# EAGLE design MG-Gadget (EAGLE 7.6.0)
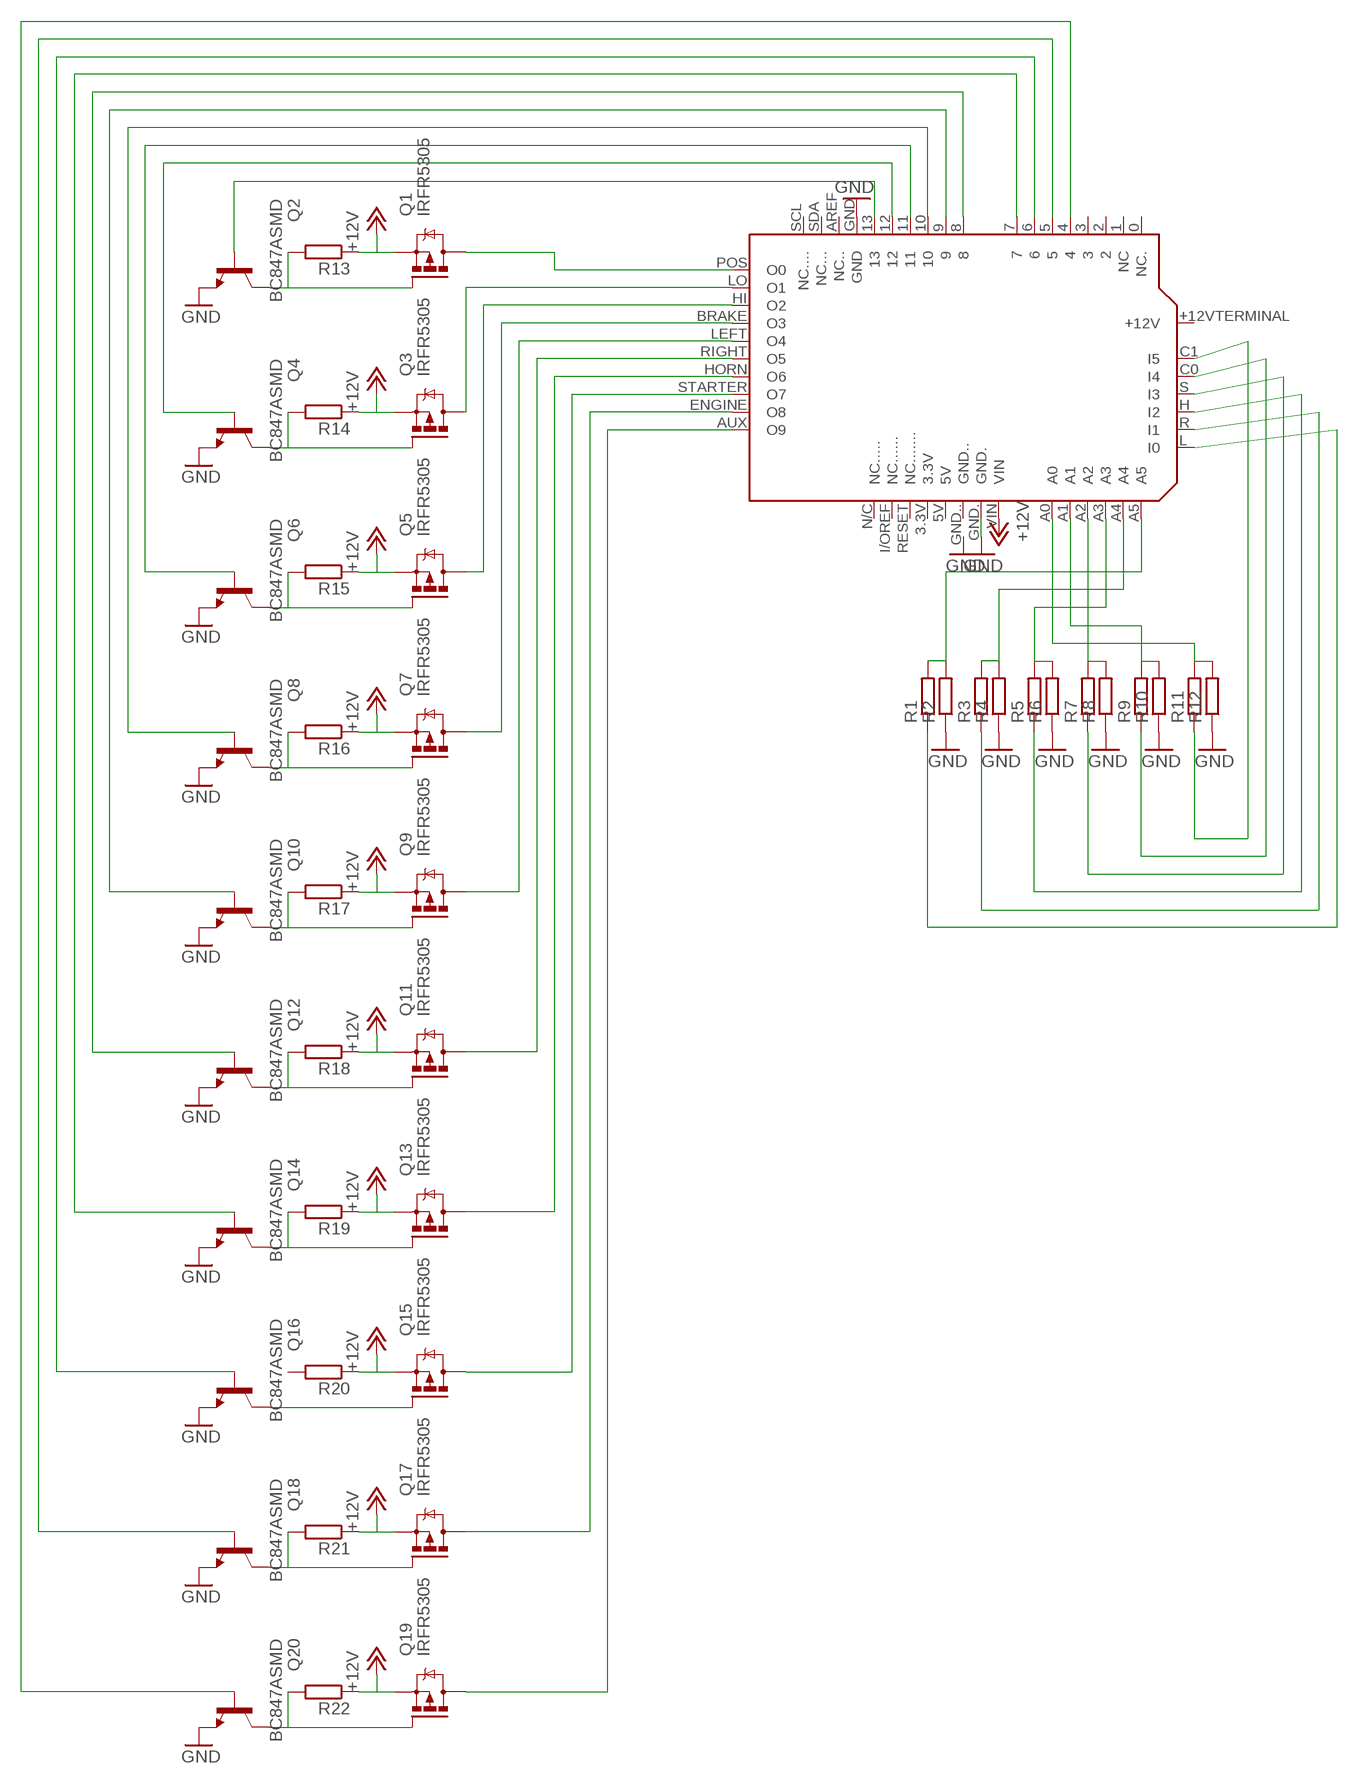
[diagram p0: schematic, sheet 1]

## Parts
PCB1  ARDUINO_UNO  [ARDUINO_UNO]
Q1  IRFR5305  [D-PAK_TO252AA]
Q2  BC847ASMD  [SOT23]
Q3  IRFR5305  [D-PAK_TO252AA]
Q4  BC847ASMD  [SOT23]
Q5  IRFR5305  [D-PAK_TO252AA]
Q6  BC847ASMD  [SOT23]
Q7  IRFR5305  [D-PAK_TO252AA]
Q8  BC847ASMD  [SOT23]
Q9  IRFR5305  [D-PAK_TO252AA]
Q10  BC847ASMD  [SOT23]
Q11  IRFR5305  [D-PAK_TO252AA]
Q12  BC847ASMD  [SOT23]
Q13  IRFR5305  [D-PAK_TO252AA]
Q14  BC847ASMD  [SOT23]
Q15  IRFR5305  [D-PAK_TO252AA]
Q16  BC847ASMD  [SOT23]
Q17  IRFR5305  [D-PAK_TO252AA]
Q18  BC847ASMD  [SOT23]
Q19  IRFR5305  [D-PAK_TO252AA]
Q20  BC847ASMD  [SOT23]
R1  R-EU_R0805  [R0805]
R2  R-EU_R0805  [R0805]
R3  R-EU_R0805  [R0805]
R4  R-EU_R0805  [R0805]
R5  R-EU_R0805  [R0805]
R6  R-EU_R0805  [R0805]
R7  R-EU_R0805  [R0805]
R8  R-EU_R0805  [R0805]
R9  R-EU_R0805  [R0805]
R10  R-EU_R0805  [R0805]
R11  R-EU_R0805  [R0805]
R12  R-EU_R0805  [R0805]
R13  R-EU_R0805  [R0805]
R14  R-EU_R0805  [R0805]
R15  R-EU_R0805  [R0805]
R16  R-EU_R0805  [R0805]
R17  R-EU_R0805  [R0805]
R18  R-EU_R0805  [R0805]
R19  R-EU_R0805  [R0805]
R20  R-EU_R0805  [R0805]
R21  R-EU_R0805  [R0805]
R22  R-EU_R0805  [R0805]

## Nets
+12V: PCB1.VIN Q1.3(S) Q3.3(S) Q5.3(S) Q7.3(S) Q9.3(S) Q11.3(S) Q13.3(S) Q15.3(S) Q17.3(S) Q19.3(S) R13.1 R14.1 R15.1 R16.1 R17.1 R18.1 R19.1 R20.1 R21.1 R22.1
GND: PCB1.GND PCB1.GND. Q2.2(E) Q4.2(E) Q6.2(E) Q8.2(E) Q10.2(E) Q12.2(E) Q14.2(E) Q16.2(E) Q18.2(E) Q20.2(E) R2.1 R4.1 R6.1 R8.1 R10.1 R12.1
N$1: PCB1.A5 R1.2 R2.2
N$2: PCB1.A4 R3.2 R4.2
N$3: PCB1.A3 R5.2 R6.2
N$4: PCB1.A2 R7.2 R8.2
N$5: PCB1.A1 R9.2 R10.2
N$6: PCB1.A0 R11.2 R12.2
N$7: PCB1.C1(I5) R11.1
N$8: PCB1.C0(I4) R9.1
N$9: PCB1.S(I3) R7.1
N$10: PCB1.H(I2) R5.1
N$11: PCB1.R(I1) R3.1
N$12: PCB1.L(I0) R1.1
N$13: Q1.1(G) Q2.3(C) R13.2
N$15: PCB1.POS(O0) Q1.4(D)
N$16: Q3.1(G) Q4.3(C) R14.2
N$18: Q5.1(G) Q6.3(C) R15.2
N$19: PCB1.13 Q2.1(B)
N$20: Q7.1(G) Q8.3(C) R16.2
N$21: PCB1.12 Q4.1(B)
N$22: Q9.1(G) Q10.3(C) R17.2
N$23: PCB1.11 Q6.1(B)
N$24: Q11.1(G) Q12.3(C) R18.2
N$25: PCB1.10 Q8.1(B)
N$26: Q13.1(G) Q14.3(C) R19.2
N$27: PCB1.9 Q10.1(B)
N$28: Q15.1(G) Q16.3(C)
N$29: PCB1.8 Q12.1(B)
N$30: Q17.1(G) Q18.3(C) R21.2
N$31: PCB1.7 Q14.1(B)
N$32: Q19.1(G) Q20.3(C) R22.2
N$33: PCB1.6 Q16.1(B)
N$34: PCB1.LO(O1) Q3.4(D)
N$35: PCB1.HI(O2) Q5.4(D)
N$36: PCB1.BRAKE(O3) Q7.4(D)
N$37: PCB1.LEFT(O4) Q9.4(D)
N$38: PCB1.RIGHT(O5) Q11.4(D)
N$39: PCB1.HORN(O6) Q13.4(D)
N$40: PCB1.STARTER(O7) Q15.4(D)
N$41: PCB1.ENGINE(O8) Q17.4(D)
N$42: PCB1.AUX(O9) Q19.4(D)
N$43: PCB1.5 Q18.1(B)
N$44: PCB1.4 Q20.1(B)
Unconnected: PCB1.0(NC.) PCB1.1(NC) PCB1.2 PCB1.3 PCB1.3.3V PCB1.5V PCB1.AREF(NC..) PCB1.GND.. PCB1.I/OREF(NC......) PCB1.N/C(NC.....) PCB1.RESET(NC.......) PCB1.SCL(NC....) PCB1.SDA(NC...) R20.2

## Power pins joined to a net without a drawn wire
+12V: PCB1.+12VTERMINAL(+12V)

## Library data of the parts
PCB1 = MG-Gadget Shield:ARDUINO_UNO: Device for representing an Arduino Uno board with a footprint in an EAGLE design. Created by Dave Young for Element14. More EAGLE documentation at: http://www.element14.com/community/community/knode/cadsoft_eagle
Q1 Q3 Q5 Q7 Q9 Q11 Q13 Q15 Q17 Q19 = transistor-power:IRF?5305: HEXFET Power MOSFET Source: http://www.irf.com/product-info/datasheets/data/irfr5305pbf.pdf
Q2 Q4 Q6 Q8 Q10 Q12 Q14 Q16 Q18 Q20 = transistor-npn:BC847*: NPN Transistor
R1-R22 = rcl:R-EU_: RESISTOR, European symbol

## Board
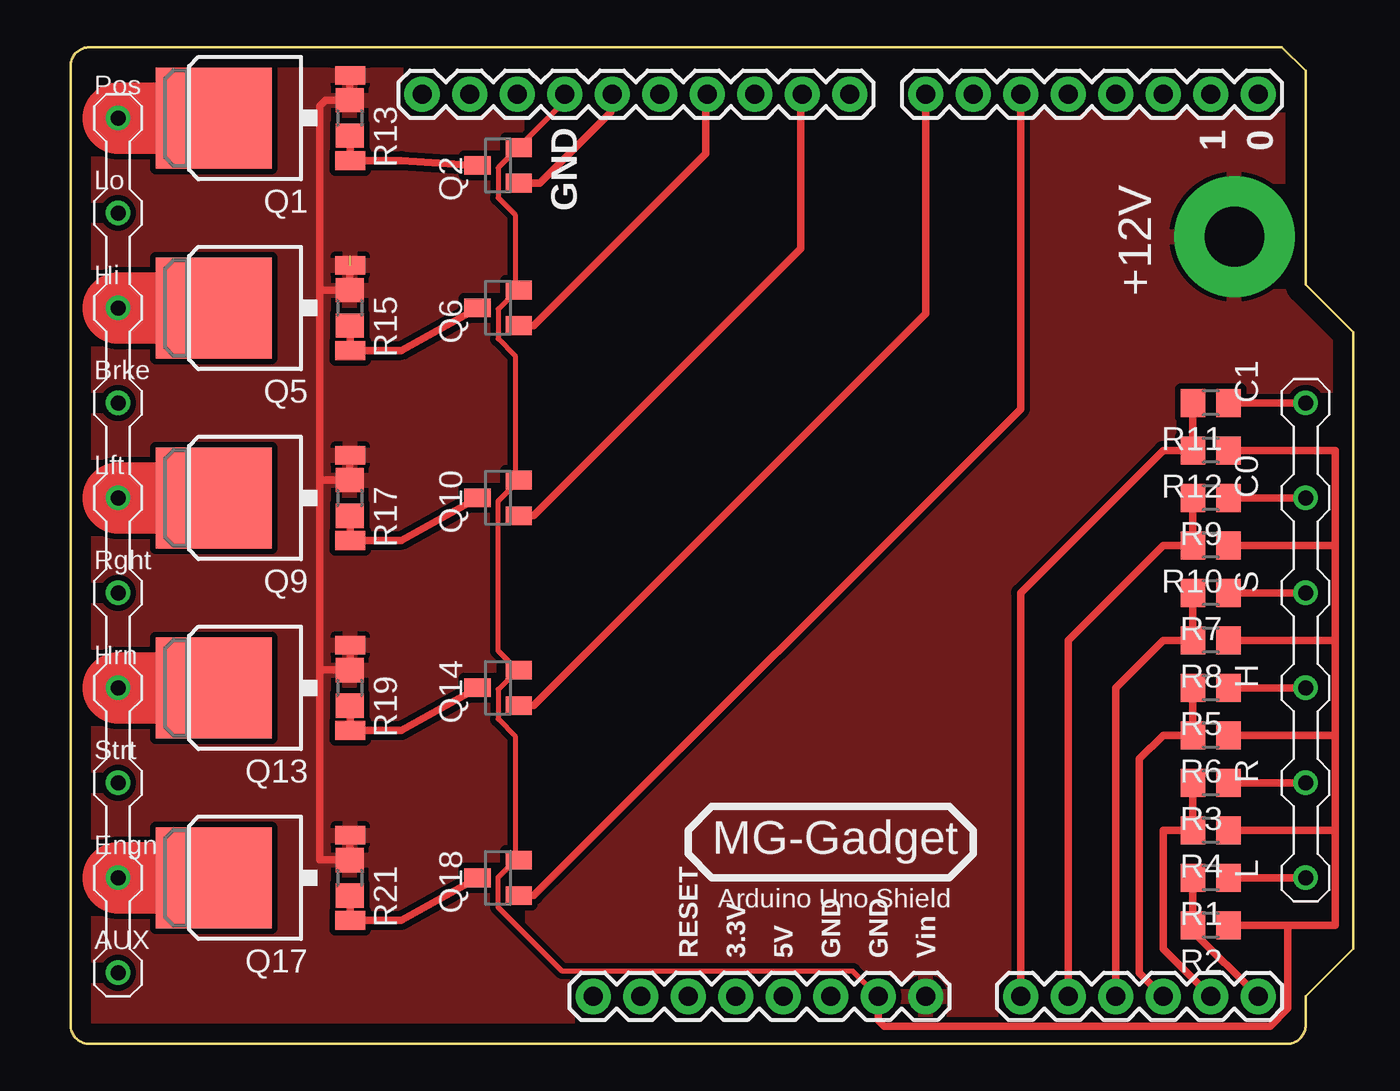
[diagram p1: board, top side]
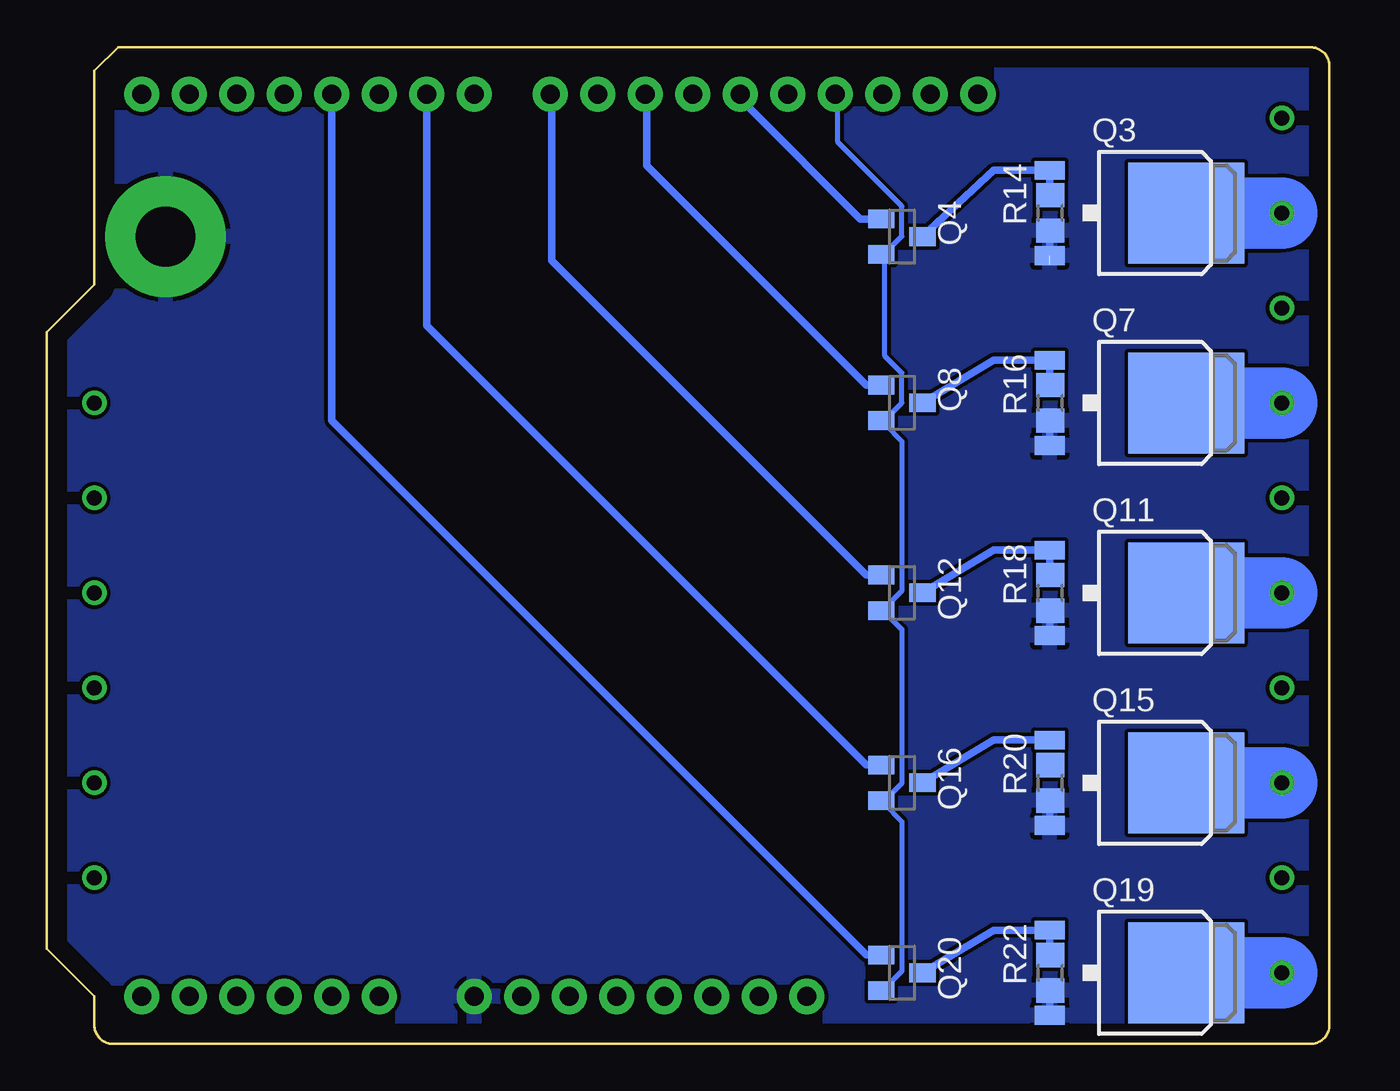
[diagram p2: board, bottom side, seen from below]

Size 68.58 x 53.31 mm. Coordinates in mm from the lower left corner, seen from the top.
Copper layers (1*16): Top 0.035mm / dielectric 1.5mm / Bottom 0.035mm
Design rules "default": minimum track width 10mil, minimum drill 24mil, track to track 8mil, track to pad 8mil, pad to pad 8mil, via to via 8mil, smd to smd 8mil, copper to edge 40mil, drill to drill 8mil, minimum pad ring 10mil, minimum via ring 8mil, stop-mask expansion 4mil, vias tented up to drill 0mil, thermal gap 10mil

### Footprints (pad centres in the part's own frame; a part is rotated, then mirrored left to right if it is on the bottom)
ARDUINO_UNO = drill 1.016 pad 1.88: 0 63.5,50.8; 1 60.96,50.8; 2 58.42,50.8; 3 55.88,50.8; 3.3V 35.56,2.54; 4 53.34,50.8; 5 50.8,50.8; 5V 38.1,2.54; 6 48.26,50.8; 7 45.72,50.8; 8 41.656,50.8; 9 39.116,50.8; 10 36.576,50.8; 11 34.036,50.8; 12 31.496,50.8; 13 28.956,50.8; A0 50.8,2.54; A1 53.34,2.54; A2 55.88,2.54; A3 58.42,2.54; A4 60.96,2.54; A5 63.5,2.54; AREF 23.876,50.8; GND 26.416,50.8; GND. 43.18,2.54; GND.. 40.64,2.54; I/OREF 30.48,2.54; N/C 27.94,2.54; RESET 33.02,2.54; SCL 18.796,50.8; SDA 21.336,50.8; VIN 45.72,2.54 | drill 3.2 pad 6.452: +12VTERMINAL 62.23,43.18 | drill 0.8: AUX 2.54,3.81; BRAKE 2.54,34.29; C0 66.04,29.21; C1 66.04,34.29; ENGINE 2.54,8.89; H 66.04,19.05; HI 2.54,39.37; HORN 2.54,19.05; L 66.04,8.89; LEFT 2.54,29.21; LO 2.54,44.45; POS 2.54,49.53; R 66.04,13.97; RIGHT 2.54,24.13; S 66.04,24.13; STARTER 2.54,13.97
D-PAK_TO252AA = smd 1 x 1.6: 1 -2.28,-4.8; 3 2.28,-4.8 | smd 5.4 x 6.2: 4 0,2.5
SOT23 = smd 1 x 1.4: 1 -0.95,-1.1; 2 0.95,-1.1; 3 0,1.1
R0805 = smd 1.3 x 1.5: 1 -0.95,0; 2 0.95,0

### Placement (x,y rotation side)
PCB1  0,0 0 top
Q1  10.16,49.53 90 top
Q2  22.86,46.99 90 top
Q3  10.16,44.45 270 bottom
Q4  22.86,43.18 270 bottom
Q5  10.16,39.37 90 top
Q6  22.86,39.37 90 top
Q7  10.16,34.29 270 bottom
Q8  22.86,34.29 270 bottom
Q9  10.16,29.21 90 top
Q10  22.86,29.21 90 top
Q11  10.16,24.13 270 bottom
Q12  22.86,24.13 270 bottom
Q13  10.16,19.05 90 top
Q14  22.86,19.05 90 top
Q15  10.16,13.97 270 bottom
Q16  22.86,13.97 270 bottom
Q17  10.16,8.89 90 top
Q18  22.86,8.89 90 top
Q19  10.16,3.81 270 bottom
Q20  22.86,3.81 270 bottom
R1  60.96,8.89 180 top
R2  60.96,6.35 180 top
R3  60.96,13.97 180 top
R4  60.96,11.43 180 top
R5  60.96,19.05 180 top
R6  60.96,16.51 180 top
R7  60.96,24.13 180 top
R8  60.96,21.59 180 top
R9  60.96,29.21 180 top
R10  60.96,26.67 180 top
R11  60.96,34.29 180 top
R12  60.96,31.75 180 top
R13  14.92,49.53 270 top
R14  14.92,44.45 90 bottom
R15  14.92,39.37 270 top
R16  14.92,34.29 90 bottom
R17  14.92,29.21 270 top
R18  14.92,24.13 90 bottom
R19  14.92,19.05 270 top
R20  14.92,13.97 90 bottom
R21  14.92,8.89 270 top
R22  14.92,3.81 90 bottom

### Tracks (layer width: path | path; a pad name or v marks a point on that pad's centre or on a via)
+12V  (1 unrouted)
  Top 0.406: Q1.3 14.92,51.81 R13.1 13.65,50.48 13.34,50.16 13.34,40.32 | Q5.3 14.92,41.65 R15.1 13.34,40.32 | Q9.3 14.92,31.49 R17.1 13.34,30.16 | Q13.3 14.96,20 R19.1 13.34,20 | Q17.3 14.92,11.17 R21.1 13.34,9.84 13.34,20 | 13.34,30.16 13.34,40.32 | 13.34,20 13.34,30.16
  Bottom 0.406: R14.1 14.96,43.5 Q3.3 | R16.1 14.96,33.34 Q7.3 | R18.1 14.96,23.18 Q11.3 | R20.1 14.96,13.02 Q15.3 | R22.1 14.96,2.86 Q19.3
  pour Top (isolate 0.305): 1.27,53.34 64.77,53.34 66.04,52.07 66.04,40.64 68.58,38.1 68.58,5.08 66.04,2.54 66.04,1.27 64.77,0 1.27,0 0,1.27 0,52.07
  pour Bottom: 0,52.07 1.27,53.34 64.77,53.34 66.04,52.07 66.04,40.64 68.58,38.1 68.58,5.08 66.04,2.54 66.04,1.27 64.77,0 1.27,0 0,1.27
GND
  Top 0.254: PCB1.GND 26.29,50.75 26.29,50.29 24,48.01 Q2.2 23.77,47.78 22.86,46.86 22.86,45.26 23.77,44.35 23.77,40.46 Q6.2 23.77,40.23 22.86,39.32 22.86,37.72 23.77,36.8 23.77,30.18 Q10.2 23.77,29.95 22.86,29.03 22.86,21.03 23.77,20.12 Q14.2 23.77,19.89 22.86,18.97 22.86,17.37 23.77,16.46 23.77,10.06 Q18.2 23.77,9.83 22.86,8.91 22.86,7.32 26.29,3.89 41.83,3.89 PCB1.GND.
  Top 0.406: R12.1 67.63,31.75 67.63,26.67 | 67.63,26.67 R10.1 | R8.1 67.63,21.59 | 67.63,21.59 67.63,26.67 | R6.1 67.63,16.51 | 67.63,16.51 67.63,21.59 | R4.1 67.63,11.43 | 67.63,11.43 67.63,16.51 | R2.1 65.09,6.35 | 65.09,6.35 67.63,6.35 67.63,11.43 | PCB1.GND. 43.18,1.27 43.5,0.95 64.14,0.95 65.09,1.91 65.09,6.35
  Bottom 0.254: Q20.2 23.77,2.97 22.86,3.89 22.86,11.89 23.77,12.8 Q16.2 23.77,13.03 22.86,13.95 22.86,22.17 23.77,23.09 Q12.2 23.77,23.32 22.86,24.23 22.86,32.23 23.77,33.15 Q8.2 23.77,33.38 22.86,34.29 22.86,35.89 23.77,36.8 23.77,42.06 Q4.2 23.77,42.29 22.86,43.2 22.86,44.81 26.29,48.23 26.29,50.75 PCB1.GND
N$1
  Top 0.406: R1.2 R2.2 60.01,6.03 PCB1.A5
N$2
  Top 0.406: R3.2 R4.2 58.42,11.43 58.42,5.08 PCB1.A4
N$3
  Top 0.406: R5.2 R6.2 58.42,16.51 57.15,15.24 57.15,3.81 PCB1.A3
N$4
  Top 0.406: R7.2 R8.2 58.42,21.59 55.88,19.05 PCB1.A2
N$5
  Top 0.406: R9.2 R10.2 58.42,26.67 53.34,21.59 PCB1.A1
N$6
  Top 0.406: R11.2 R12.2 58.42,31.75 50.8,24.13 PCB1.A0
N$7
  Top 0.406: R11.1 PCB1.C1
N$8
  Top 0.406: PCB1.C0 R9.1
N$9
  Top 0.406: PCB1.S R7.1
N$10
  Top 0.406: PCB1.H R5.1
N$11
  Top 0.406: PCB1.R R3.1
N$12
  Top 0.406: R1.1 PCB1.L
N$13
  Top 0.406: Q2.3 17.69,47.25 Q1.1 14.96,48.58 R13.2
N$15
  Top 3.81: PCB1.POS Q1.4
N$16
  Bottom 0.406: Q4.3 17.95,46.73 Q3.1 14.96,45.4 R14.2
N$18
  Top 0.406: Q6.3 17.69,37.09 Q5.1 14.96,38.42 R15.2
N$19
  Top 0.406: Q2.1 25.08,46.04 28.89,49.85 28.89,50.74 PCB1.13
N$20
  Bottom 0.406: Q8.3 17.95,36.57 Q7.1 14.96,35.24 R16.2
N$21
  Bottom 0.406: Q4.1 25.08,44.13 31.11,50.16 31.11,50.42 PCB1.12
N$22
  Top 0.406: Q10.3 17.69,26.93 Q9.1 14.96,28.26 R17.2
N$23
  Top 0.406: Q6.1 24.77,38.42 33.97,47.62 33.97,50.74 PCB1.11
N$24
  Bottom 0.406: Q12.3 17.95,26.41 Q11.1 14.96,25.08 R18.2
N$25
  Bottom 0.406: Q8.1 24.76,35.24 36.51,46.99 36.51,50.74 PCB1.10
N$26
  Top 0.406: Q14.3 17.69,16.77 Q13.1 14.96,18.1 R19.2
N$27
  Top 0.406: Q10.1 24.77,28.26 39.05,42.55 39.05,50.74 PCB1.9
N$28
  Bottom 0.406: Q15.1 17.95,16.25 Q16.3
N$29
  Bottom 0.406: Q12.1 24.76,25.08 41.59,41.91 41.59,50.74 PCB1.8
N$30
  Top 0.406: Q18.3 17.69,6.61 Q17.1 14.96,7.94 R21.2
N$31
  Top 0.406: Q14.1 24.77,18.1 45.72,39.05 PCB1.7
N$32
  Bottom 0.406: Q20.3 17.95,6.09 Q19.1 14.96,4.76 R22.2
N$33
  Bottom 0.406: Q16.1 24.76,14.92 48.26,38.42 PCB1.6
N$34
  Bottom 3.81: Q3.4 PCB1.LO
N$35
  Top 3.81: PCB1.HI Q5.4
N$36
  Bottom 3.81: PCB1.BRAKE Q7.4
N$37
  Top 3.81: PCB1.LEFT Q9.4
N$38
  Bottom 3.81: PCB1.RIGHT Q11.4
N$39
  Top 3.81: Q13.4 PCB1.HORN
N$40
  Bottom 3.81: PCB1.STARTER Q15.4
N$41
  Top 3.81: Q17.4 PCB1.ENGINE
N$42
  Bottom 3.81: PCB1.AUX Q19.4
N$43
  Top 0.406: Q18.1 24.77,7.94 50.8,33.97 PCB1.5
N$44
  Bottom 0.406: Q20.1 24.76,4.76 53.34,33.34 PCB1.4

### Text on the board
_tsilk: Pos | Lo | Hi | +12V | Brke | Lft | Rght | Hrn | Strt | Engn | MG-Gadget | Arduino Uno Shield | AUX